# Altium schematic sheet DS18B20.SchDoc
size A4; SheetNumber: 2; SheetTotal: 6
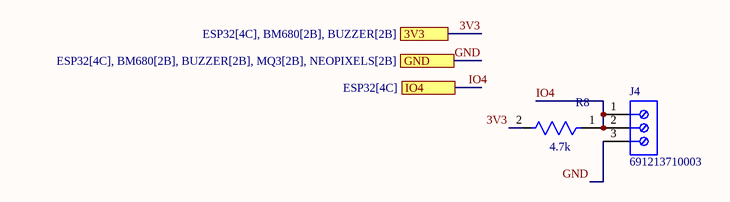
[diagram p0: DS18B20.SchDoc]

## Parts
J4  691213710003  [691213710003]
R8  4.7k  [FP-ERA6A-IPC_B]

## Ports
3V3 (see ESP32[4C], BM680[2B], BUZZER[2B]), GND (see ESP32[4C], BM680[2B], BUZZER[2B], MQ3[2B], NEOPIXELS[2B]), IO4 (see ESP32[4C])

## Nets
3V3: R8.2 ; port 3V3
GND: J4.3 ; port GND
IO4: J4.1 J4.2 R8.1 ; port IO4

## Library data of the parts
J4 = CMP-1502-02527-2: NexarPartId: 8917719; Number of Contacts: 3; Wire/Cable Gauge: 16AWG; Wire Gauge (Max): 26AWG; Connector Type: PCB, Terminal Block; Number of Levels: 1; Plating: Brass, Steel; Current: 10A; Voltage: 300V; Stripping Length: -7mm; Pitch: 5.0038mm; REACH SVHC: Unknown; Mount: Through Hole; Max Operating Temperature: 105°C; Contact Plating: Tin; Termination: Screw; Contact Material: Brass; Housing Material: Nylon; Color: Green; RoHS: Compliant; Wire Gauge (Min): 16AWG; Min Operating Temperature: -40°C; Length: 8.3mm; Packaging: Box; Number of Pins: 3; Lead Pitch: 5mm; Number of Positions Per Level: 3; Height: 10mm; Width: 15.6mm
R8 = CMP-2001-00583-2: RES 100K OHM 0.1% 1/8W 0805; Max Power Dissipation: 125mW; Voltage Rating: 100V; Resistance: 100kR; Temperature Coefficient: 25ppm/°C; Resistance Tolerance: 0.1%; Resistor Type: Thin Film; Mount: Surface Mount; Package Quantity: 1; RoHS Compliant: Yes; Features: Automotive AEC-Q200; Termination: Solder; Contact Plating: Tin; Number of Pins: 2; Construction: Rectangular; Size Code: 0805; Case/Package: 0805; Military Standard: Not; Voltage Rating (DC): 100V; Max Operating Temperature: 155°C; REACH SVHC: No SVHC; Series: ERA-6A; Case Code (Metric): 2012; Number of Terminations: 2; Tolerance: 0.1%; Width: 1.25mm; Depth: 1.25mm; Lead Free: Lead Free; Radiation Hardening: No; Length: 2mm; Technology: METAL FILM; Power Rating: 125mW; Min Operating Temperature: -55°C; Height: 0.5mm; Case Code (Imperial): 0805; Packaging: Tape and Reel